# Altium schematic sheet MCU.SchDoc
size Tabloid; SheetNumber: 3; SheetTotal: 5
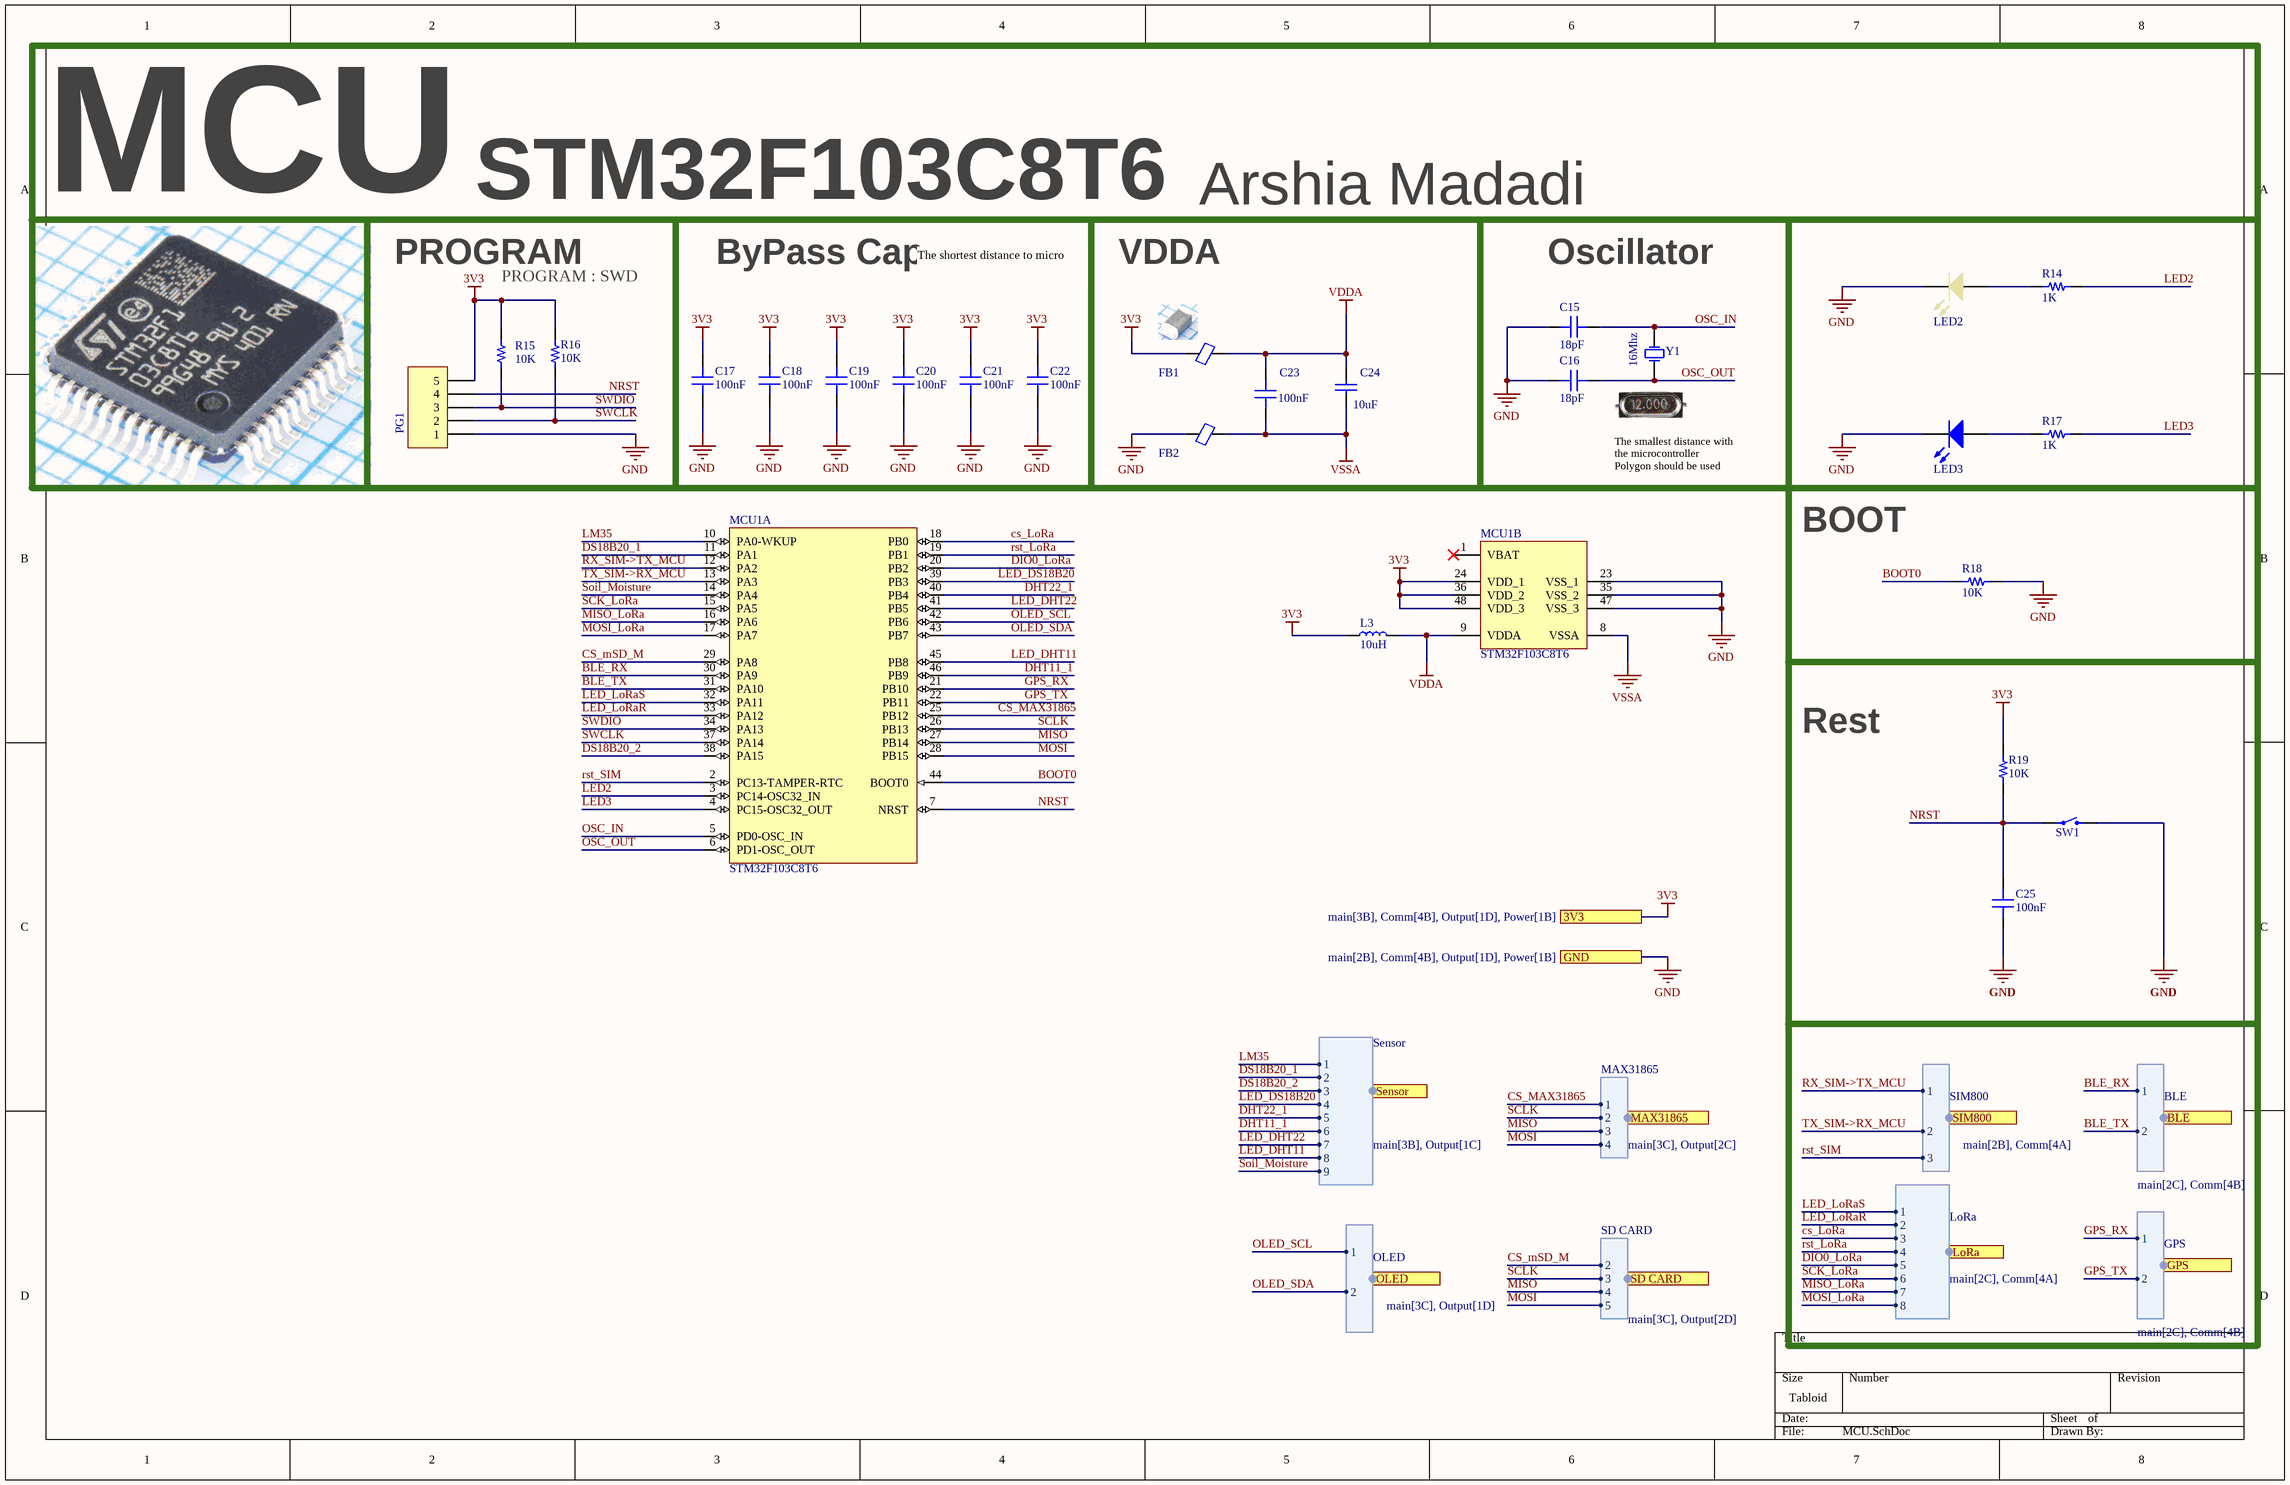
[diagram p0: MCU.SchDoc]

## Parts
C15  18pF  [CAP 0603_1608]
C16  18pF  [CAP 0603_1608]
C17  100nF  [CAP 0603_1608]
C18  100nF  [CAP 0603_1608]
C19  100nF  [CAP 0603_1608]
C20  100nF  [CAP 0603_1608]
C21  100nF  [CAP 0603_1608]
C22  100nF  [CAP 0603_1608]
C23  100nF  [CAP 0603_1608]
C24  10uF  [MY_CAP_SMD_0603]
C25  100nF  [CAP 0603_1608]
FB1  Ferrite Bead SMD  [FB1206]  (value not drawn)
FB2  Ferrite Bead SMD  [FB1206]  (value not drawn)
L3  10uH  [IND 1206_3216]
LED2  LED SMD 0805 WHITE  [LED_0805_WHITE]  (value not drawn)
LED3  LED SMD 0805 BLUE  [LED_0805_RED]  (value not drawn)
MCU1  STM32F103C8T6  [QFP50P900X900X160-48N]  (parts A,B of 2)
PG1  Header 5  [My_1X05]  (value not drawn)
R14  1K  [RES 0603_1608]
R15  10K  [RES 0603_1608]
R16  10K  [RES 0603_1608]
R17  1K  [RES 0603_1608]
R18  10K  [RES 0603_1608]
R19  10K  [RES 0603_1608]
SW1  Tactile 2PIN 6X3.5mm H4.57mm (SMD)  [SWPBS_SPST_6X3X5]  (value not drawn)
Y1  16Mhz  [Crystal]

## Blocks framed on the sheet
MCU: C15-C24 FB1 FB2 LED2 LED3 PG1 R14-R17 Y1
BOOT: R18
Rest: C25 R19 SW1

## Ports
3V3 (see main[3B], Comm[4B], Output[1D], Power[1B]), BLE (harness BLE, see main[2C], Comm[4B]), GND (see main[2B], Comm[4B], Output[1D], Power[1B]), GPS (harness GPS, see main[2C], Comm[4B]), LoRa (harness LORA, see main[2C], Comm[4A]), MAX31865 (harness MAX31865, see main[3C], Output[2C]), OLED (harness OLED, see main[3C], Output[1D]), SD CARD (harness SD CARD, see main[3C], Output[2D]), Sensor (harness Sensor, see main[3B], Output[1C]), SIM800 (harness SIM800, see main[2B], Comm[4A])

## Harnesses
SIM800: 1, 2, 3
LoRa: 1, 2, 3, 4, 5, 6, 7, 8
Sensor: 1, 2, 3, 4, 5, 6, 7, 8, 9
BLE: 1, 2
GPS: 1, 2
MAX31865: 1, 2, 3, 4
SD CARD: 2, 3, 4, 5
OLED: 1, 2

## Nets
3V3: C17.2 C18.2 C19.2 C20.2 C21.2 C22.2 FB1.1 L3.1 MCU1.24(VDD_1) MCU1.36(VDD_2) MCU1.48(VDD_3) PG1.5 R15.1 R16.1 R19.1 ; port 3V3
GND: C15.2 C16.2 C17.1 C18.1 C19.1 C20.1 C21.1 C22.1 C25.1 FB2.1 LED2.2(K) LED3.2(K) MCU1.23(VSS_1) MCU1.35(VSS_2) MCU1.47(VSS_3) PG1.1 R18.1 SW1.2 ; port GND
VDDA: C23.2 C24.1 FB1.2 L3.2 MCU1.9(VDDA)
VSSA: C23.1 C24.2 FB2.2 MCU1.8(VSSA)
BLE_RX: MCU1.30(PA9) ; port BLE.1
BLE_TX: MCU1.31(PA10) ; port BLE.2
BOOT0: MCU1.44(BOOT0) R18.2
cs_LoRa: MCU1.18(PB0) ; port LoRa.3
CS_MAX31865: MCU1.25(PB12) ; port MAX31865.1
CS_mSD_M: MCU1.29(PA8) ; port SD CARD.2
DHT11_1: MCU1.46(PB9) ; port Sensor.6
DHT22_1: MCU1.40(PB4) ; port Sensor.5
DIO0_LoRa: MCU1.20(PB2) ; port LoRa.5
DS18B20_1: MCU1.11(PA1) ; port Sensor.2
DS18B20_2: MCU1.38(PA15) ; port Sensor.3
GPS_RX: MCU1.21(PB10) ; port GPS.1
GPS_TX: MCU1.22(PB11) ; port GPS.2
LED2: MCU1.3(PC14-OSC32_IN) R14.1
LED3: MCU1.4(PC15-OSC32_OUT) R17.1
LED_DHT11: MCU1.45(PB8) ; port Sensor.8
LED_DHT22: MCU1.41(PB5) ; port Sensor.7
LED_DS18B20: MCU1.39(PB3) ; port Sensor.4
LED_LoRaR: MCU1.33(PA12) ; port LoRa.2
LED_LoRaS: MCU1.32(PA11) ; port LoRa.1
LM35: MCU1.10(PA0-WKUP) ; port Sensor.1
MISO: MCU1.27(PB14) ; port MAX31865.3, port SD CARD.4
MISO_LoRa: MCU1.16(PA6) ; port LoRa.7
MOSI: MCU1.28(PB15) ; port MAX31865.4, port SD CARD.5
MOSI_LoRa: MCU1.17(PA7) ; port LoRa.8
NRST: C25.2 MCU1.7(NRST) PG1.4 R19.2 SW1.1
OLED_SCL: MCU1.42(PB6) ; port OLED.1
OLED_SDA: MCU1.43(PB7) ; port OLED.2
OSC_IN: C15.1 MCU1.5(PD0-OSC_IN) Y1.2(OSC2)
OSC_OUT: C16.1 MCU1.6(PD1-OSC_OUT) Y1.1(OSC1)
rst_LoRa: MCU1.19(PB1) ; port LoRa.4
rst_SIM: MCU1.2(PC13-TAMPER-RTC) ; port SIM800.3
RX_SIM->TX_MCU: MCU1.12(PA2) ; port SIM800.1
SCK_LoRa: MCU1.15(PA5) ; port LoRa.6
SCLK: MCU1.26(PB13) ; port MAX31865.2, port SD CARD.3
Soil_Moisture: MCU1.14(PA4) ; port Sensor.9
SWCLK: MCU1.37(PA14) PG1.2 R16.2
SWDIO: MCU1.34(PA13) PG1.3 R15.2
TX_SIM->RX_MCU: MCU1.13(PA3) ; port SIM800.2
NetLED2_1: LED2.1(A) R14.2
NetLED3_1: LED3.1(A) R17.2

Not connected (* = marked no-connect by the designer): MCU1 1(VBAT)*

## Notes on the sheet
- STM32F103C8T6
- Arshia Madadi
- PROGRAM
- PROGRAM : SWD
- ByPass Cap
- The shortest distance to micro
- VDDA
- Oscillator
- The smallest distance with the microcontroller
  Polygon should be used

## Library data of the parts
C15-C23 C25 = Cap 0603: SMT Capacitor
  C15 C16: VALUE: 18pF
  C17-C23 C25: VALUE: 100nF
C24 = CAP SMD_0603: 1.6 mm × 0.8 mm
FB1 FB2 = Ferrite Bead SMD Package: Designer: Ali Hafizi
L3 = Ind 1206: SMT Inductor; Value: 10uH
MCU1 = STM32F103C8T6: ARM Cortex-M3 32-bit MCU, 64 KB Flash, 20 KB Internal RAM, 37 I/Os, 48-pin LQFP, -40 to 85 degC, Tray; A/D Converter: 2x12-bit (10 Channel); FLASH Size (Prog) (kB): 64; I/Os (High Current): 37; Internal RAM Size (kB): 20; Operating Frequency(F) (Processor speed) (MHz): 72; Supply Voltage(Vcc) min (V): 2; DatasheetVersion: Rev. 16; PackageVersion: Rev. 6, 06/2013; PackageReference: LQFP48; PackageDescription: 48-Pin Low Profile Quad Flat Package, 7 x 7 mm Body, 0.5 mm Pitch; Supplier 1: Digi-Key; Supplier Part Number 1: 497-6063-ND; Supplier 2: Farnell; Supplier Part Number 2: 1447637; Supplier 3: Newark; Supplier Part Number 3: 59M2182; Supplier 4: Newark; Supplier Part Number 4: 57P1222; Supplier 5: Mouser; Supplier Part Number 5: 511-STM32F103C8T6; Core: ARM Cortex-M3; Packing: Tray; Mounting Technology: Surface Mount; PartNumber: STM32F103C8T6; ComponentLink1Description: Manufacturer URL; ComponentLink1URL: http://www.st.com/web/en/home.html; ComponentLink2Description: Datasheet; ComponentLink2URL: http://www.st.com/st-web-ui/static/active/en/resource/technical/document/datasheet/CD00161566.pdf; ComponentLink3Description: Package Specification; ComponentLink3URL: http://www.st.com/st-web-ui/static/active/en/resource/technical/document/datasheet/DM00058181.pdf
PG1 = Header 5: Header, 5-Pin; LatestRevisionDate: 17-Jul-2002; LatestRevisionNote: Re-released for DXP Platform.; Publisher: Altium Limited
R14 R17 = Res 0603: SMT Resistor; VALUE: 10K
R15 R16 R18 R19 = Res 0603: SMT Resistor; VALUE: 10K
SW1 = Tactile 2PIN 6X3.5mm H4.57mm (SMD): Tactile Switch SPST-NO Top Actuated Surface Mount; PartNumber: FSMSMTR-ND
Y1 = XTAL: Crystal Oscillator; Published: 8-Jun-2000; LatestRevisionDate: 17-Jul-2002; LatestRevisionNote: Re-released for DXP Platform.; PackageReference: R38; Publisher: Altium Limited